# Altium schematic sheet Car_Circuitry.SchDoc
size A3; SheetNumber: 1; SheetTotal: 1
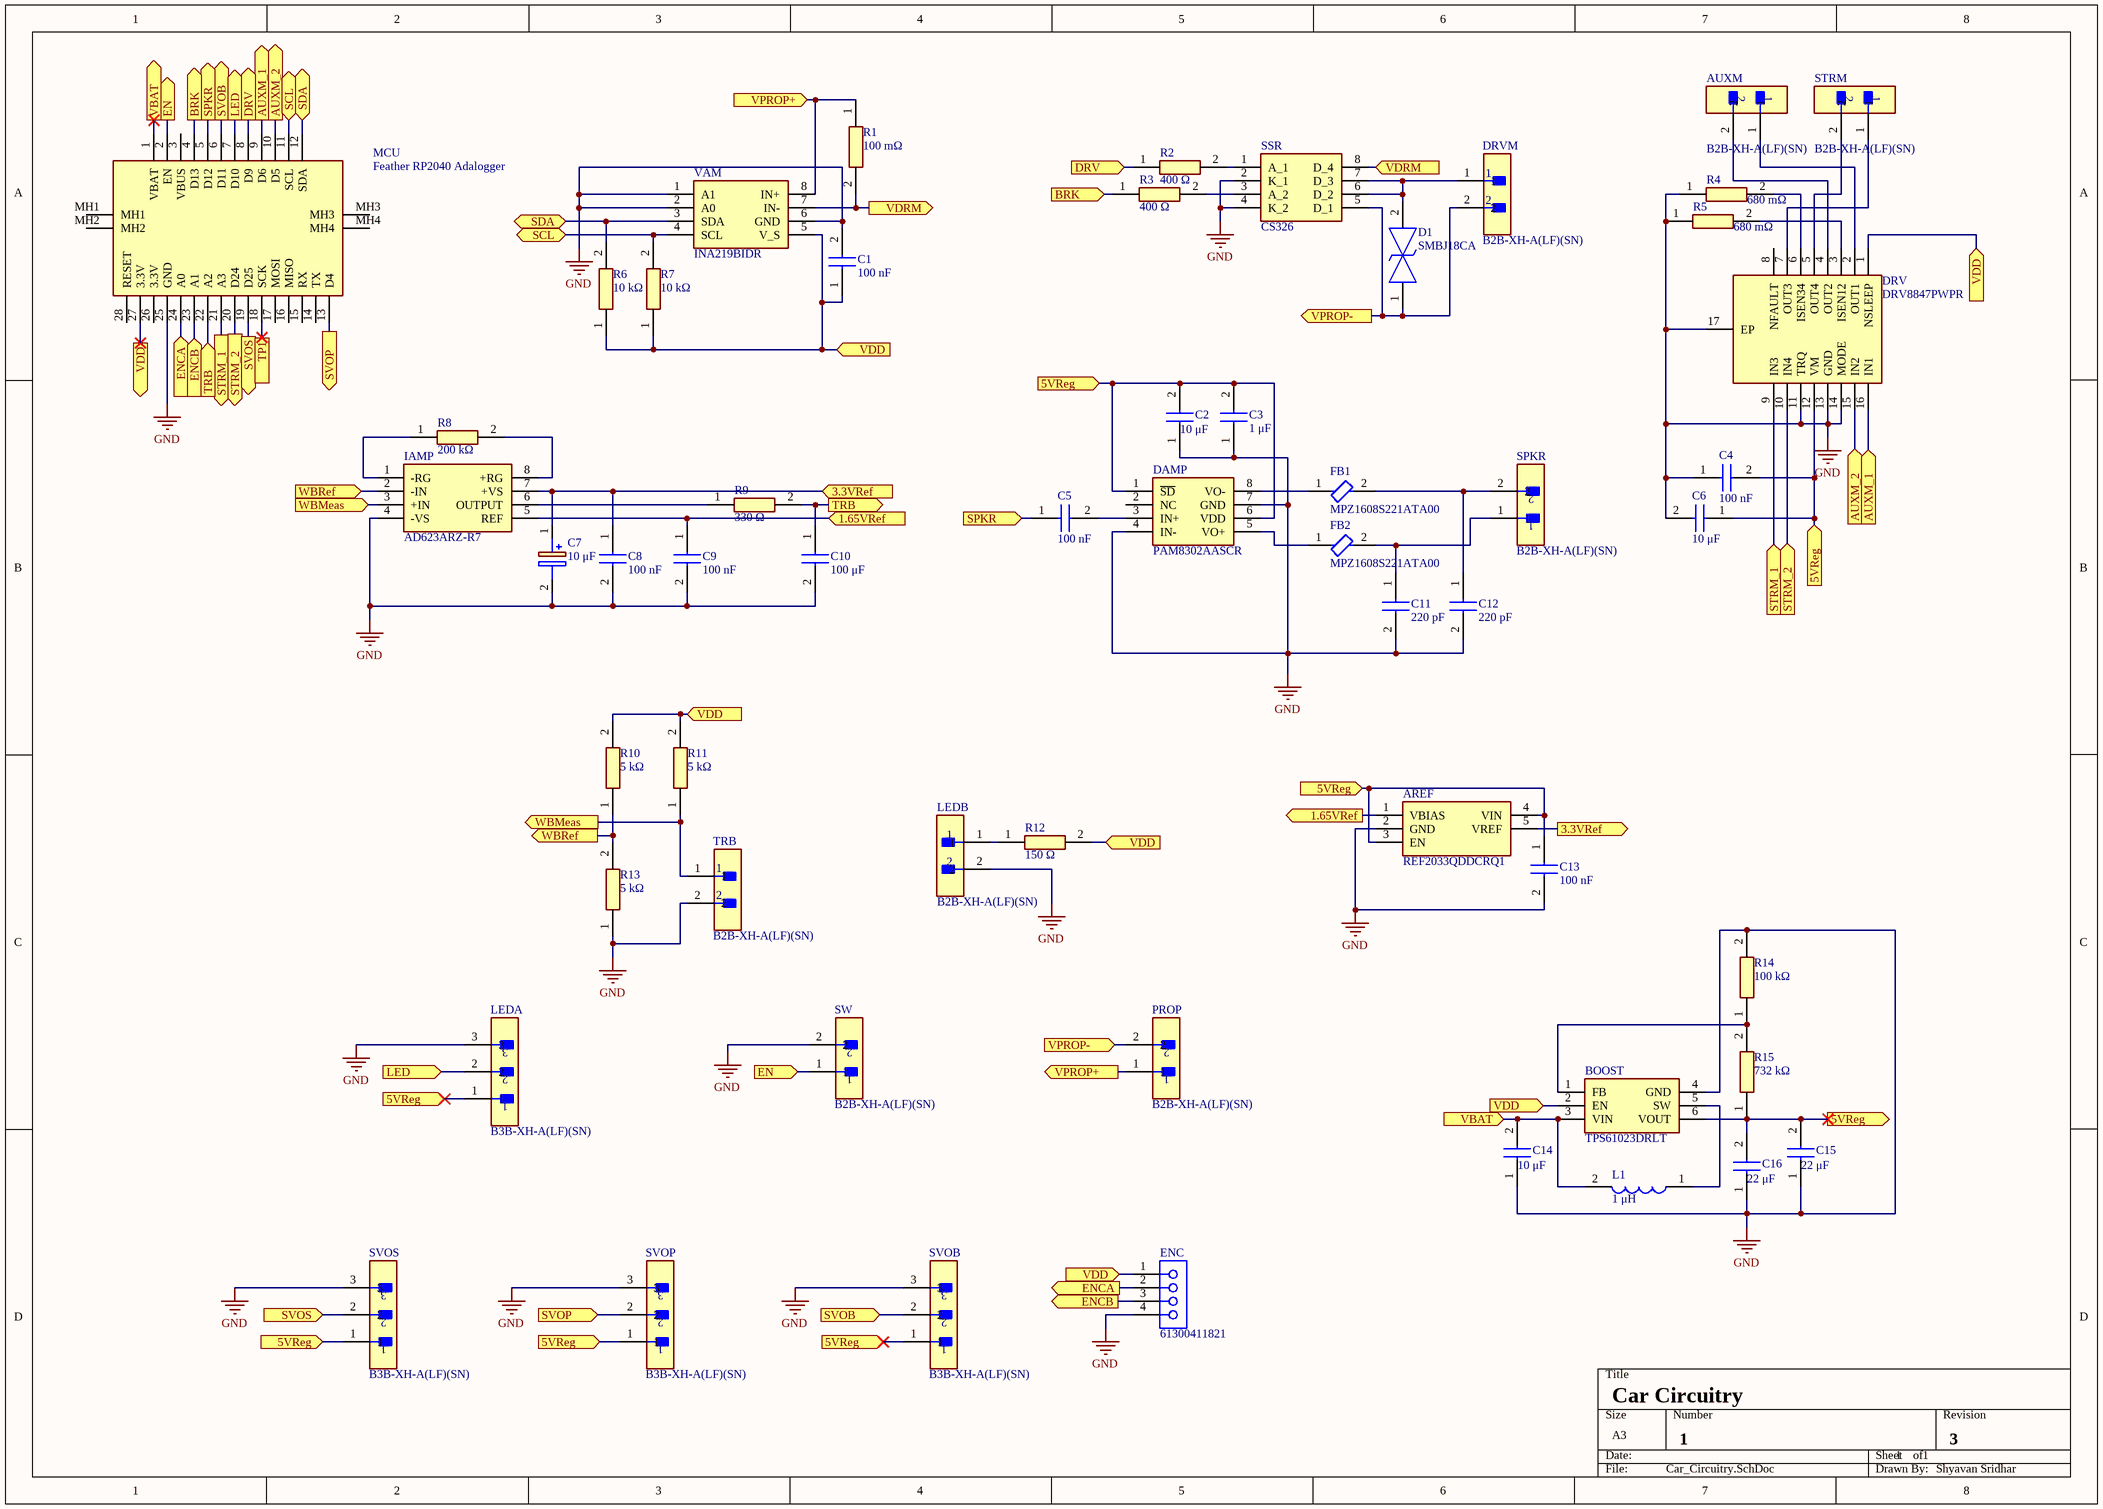
[diagram p0: Car_Circuitry.SchDoc]

## Parts
AREF  REF2033QDDCRQ1  [SOT95P280X110-5N]
AUXM  B2B-XH-A(LF)(SN)  [FP-B2B-XH-A_LF_SN-MFG]
BOOST  TPS61023DRLT  [SOTFL50P160X60-6N]
C1  100 nF  [CAPC2012X95N]
C2  10 μF  [CAPC2012X140N]
C3  1 μF  [C0402C104J4RACTU]
C4  100 nF  [CAPC2012X95N]
C5  100 nF  [CAPC2012X95N]
C6  10 μF  [CAPC2012X140N]
C7  10 μF  [CAPPM3528X210N]
C8  100 nF  [CAPC2012X95N]
C9  100 nF  [CAPC2012X95N]
C10  100 μF  [GRM31x]
C11  220 pF  [GRM033D70J224ME01D]
C12  220 pF  [GRM033D70J224ME01D]
C13  100 nF  [CAPC2012X95N]
C14  10 μF  [CAPC2012X140N]
C15  22 μF  [CAPC3216X180N]
C16  22 μF  [CAPC3216X180N]
D1  SMBJ18CA  [DIOM5436X261N]
DAMP  PAM8302AASCR  [SOP65P490X110-8N]
DRV  DRV8847PWPR  [SOP65P640X120-17N]
DRVM  B2B-XH-A(LF)(SN)  [FP-B2B-XH-A_LF_SN-MFG]
ENC  61300411821  [61300411821]
FB1  MPZ1608S221ATA00  [FP-MPZ1608-0_8-MFG]
FB2  MPZ1608S221ATA00  [FP-MPZ1608-0_8-MFG]
IAMP  AD623ARZ-R7  [SOIC127P600X175-8N]
L1  1 μH  [74438357010]
LEDA  B3B-XH-A(LF)(SN)  [FP-B3B-XH-A_LF_SN-MFG]
LEDB  B2B-XH-A(LF)(SN)  [FP-B2B-XH-A_LF_SN-MFG]
MCU  Feather RP2040 Adalogger  [2796]
PROP  B2B-XH-A(LF)(SN)  [FP-B2B-XH-A_LF_SN-MFG]
R1  100 mΩ  [RESC2013X65N]
R2  400 Ω  [RESC1608X46N]
R3  400 Ω  [RESC1608X46N]
R4  680 mΩ  [ERJ6_B_BW_R_LW_CW_D]
R5  680 mΩ  [ERJ6_B_BW_R_LW_CW_D]
R6  10 kΩ  [RESC1005X40N]
R7  10 kΩ  [RESC1005X40N]
R8  200 kΩ  [ERA6AEB101V]
R9  330 Ω  [RESC1005X40N]
R10  5 kΩ  [RESC0603X26N]
R11  5 kΩ  [RESC0603X26N]
R12  150 Ω  [RESC2012X60N]
R13  5 kΩ  [RESC0603X26N]
R14  100 kΩ  [ERJ8ENF1000V]
R15  732 kΩ  [ERJ8ENF1000V]
SPKR  B2B-XH-A(LF)(SN)  [FP-B2B-XH-A_LF_SN-MFG]
SSR  CS326  [SOP254P1030X390-8N]
STRM  B2B-XH-A(LF)(SN)  [FP-B2B-XH-A_LF_SN-MFG]
SVOB  B3B-XH-A(LF)(SN)  [FP-B3B-XH-A_LF_SN-MFG]
SVOP  B3B-XH-A(LF)(SN)  [FP-B3B-XH-A_LF_SN-MFG]
SVOS  B3B-XH-A(LF)(SN)  [FP-B3B-XH-A_LF_SN-MFG]
SW  B2B-XH-A(LF)(SN)  [FP-B2B-XH-A_LF_SN-MFG]
TRB  B2B-XH-A(LF)(SN)  [FP-B2B-XH-A_LF_SN-MFG]
VAM  INA219BIDR  [SOIC127P600X175-8N]

## Ports
1.65VRef (in), 1.65VRef (out), 3.3VRef (in), 3.3VRef (out), 5VReg (in), 5VReg (out), AUXM_1 (in), AUXM_1 (out), AUXM_2 (in), AUXM_2 (out), BRK (in), BRK (out), DRV (in), DRV (out), EN (in), EN (out), ENCA (in), ENCA (out), ENCB (in), ENCB (out), LED (in), LED (out), SCL (bidir), SDA (bidir), SPKR (in), SPKR (out), STRM_1 (in), STRM_1 (out), STRM_2 (in), STRM_2 (out), SVOB (in), SVOB (out), SVOP (in), SVOP (out), SVOS (in), SVOS (out), TP1, TRB (in), TRB (out), VBAT (in), VBAT (out), VDD (in), VDD (out), VDRM (in), VDRM (out), VPROP+ (in), VPROP+ (out), VPROP- (in), VPROP- (out), WBMeas (in), WBMeas (out), WBRef (in), WBRef (out)

## Nets
GND: AREF.2(GND) BOOST.4(GND) C1.2 C2.1 C3.1 C4.1 C6.2 C7.2(-) C8.2 C9.2 C10.2 C11.2 C12.2 C13.2 C14.1 C15.1 C16.1 DAMP.4(IN-) DAMP.7(GND) DRV.11(TRQ) DRV.13(GND) DRV.14(MODE) DRV.17(EP) ENC.4 IAMP.4(-VS) LEDA.3 LEDB.2 MCU.25(GND) R4.1 R5.1 R13.1 R14.2 SSR.2(K_1) SSR.4(K_2) SVOB.3 SVOP.3 SVOS.3 SW.2 TRB.2 VAM.1(A1) VAM.2(A0) VAM.6(GND)
1.65VRef: AREF.1(VBIAS) C9.1 IAMP.5(REF) ; port 1.65VRef
3.3VRef: AREF.5(VREF) C7.1(+) C8.1 IAMP.7(+VS) ; port 3.3VRef
5VReg: AREF.3(EN) AREF.4(VIN) BOOST.6(VOUT) C2.2 C3.2 C4.2 C6.1 C13.1 C15.2 C16.2 DAMP.1(~{SD}) DAMP.6(VDD) DRV.12(VM) LEDA.1 R15.1 SVOB.1 SVOP.1 SVOS.1 ; port 5VReg
AUXM_1: DRV.16(IN1) MCU.9(D6) ; port AUXM_1
AUXM_2: DRV.15(IN2) MCU.10(D5) ; port AUXM_2
BRK: MCU.4(D13) R3.1 ; port BRK
DRV: MCU.8(D9) R2.1 ; port DRV
EN: MCU.2(EN) SW.1 ; port EN
ENCA: ENC.2 MCU.24(A0) ; port ENCA
ENCB: ENC.3 MCU.23(A1) ; port ENCB
LED: LEDA.2 MCU.7(D10) ; port LED
SCL: MCU.11(SCL) R7.2 VAM.4(SCL) ; port SCL
SDA: MCU.12(SDA) R6.2 VAM.3(SDA) ; port SDA
SPKR: C5.1 MCU.5(D12) ; port SPKR
STRM_1: DRV.9(IN3) MCU.21(A3) ; port STRM_1
STRM_2: DRV.10(IN4) MCU.20(D24) ; port STRM_2
SVOB: MCU.6(D11) SVOB.2 ; port SVOB
SVOP: MCU.13(D4) SVOP.2 ; port SVOP
SVOS: MCU.19(D25) SVOS.2 ; port SVOS
TP1: MCU.18(SCK) ; port TP1
TRB: C10.1 MCU.22(A2) R9.2 ; port TRB
VBAT: BOOST.3(VIN) C14.2 L1.2 MCU.1(VBAT) ; port VBAT
VDD: BOOST.2(EN) C1.1 DRV.1(NSLEEP) ENC.1 MCU.27(3.3V) R6.1 R7.1 R10.2 R11.2 R12.2 VAM.5(V_S) ; port VDD
VDRM: R1.2 SSR.8(D_4) VAM.7(IN-) ; port VDRM
VPROP+: PROP.1 R1.1 VAM.8(IN+) ; port VPROP+
VPROP-: D1.1 DRVM.2 PROP.2 SSR.5(D_1) ; port VPROP-
WBMeas: IAMP.3(+IN) R11.1 TRB.1 ; port WBMeas
WBRef: IAMP.2(-IN) R10.1 R13.2 ; port WBRef
NetAUXM_1: AUXM.1 DRV.2(OUT1)
NetAUXM_2: AUXM.2 DRV.4(OUT2)
NetBOOST_1: BOOST.1(FB) R14.1 R15.2
NetBOOST_5: BOOST.5(SW) L1.1
NetC5_2: C5.2 DAMP.3(IN+)
NetC11_1: C11.1 FB2.2 SPKR.1
NetC12_1: C12.1 FB1.2 SPKR.2
NetD1_2: D1.2 DRVM.1 SSR.6(D_2) SSR.7(D_3)
NetDAMP_5: DAMP.5(VO+) FB2.1
NetDAMP_8: DAMP.8(VO-) FB1.1
NetDRV_3: DRV.3(ISEN12) R5.2
NetDRV_5: DRV.5(OUT4) STRM.2
NetDRV_6: DRV.6(ISEN34) R4.2
NetDRV_7: DRV.7(OUT3) STRM.1
NetIAMP_1: IAMP.1(-RG) R8.1
NetIAMP_6: IAMP.6(OUTPUT) R9.1
NetIAMP_8: IAMP.8(+RG) R8.2
NetLEDB_1: LEDB.1 R12.1
NetR2_2: R2.2 SSR.1(A_1)
NetR3_2: R3.2 SSR.3(A_2)

Not connected (* = marked no-connect by the designer): DAMP 2(NC); DRV 8(NFAULT); MCU 3(VBUS) 14(TX) 15(RX) 16(MISO) 17(MOSI) 26(3.3V) 28(RESET) MH1 MH2 MH3 MH4

## Notes on the sheet
- Car Circuitry
- 1
- 3
- Shyavan Sridhar

## Library data of the parts
AREF = REF2033QDDCRQ1: Integrated Circuit; Manufacturer_Name: Texas Instruments; Datasheet Link: https://www.arrow.com/en/products/ref2033qddcrq1/texas-instruments?region=nac; Height: 1.1mm; Manufacturer_Part_Number: REF2033QDDCRQ1; Mouser Part Number: 595-REF2033QDDCRQ1; Mouser Price/Stock: https://www.mouser.co.uk/ProductDetail/Texas-Instruments/REF2033QDDCRQ1?qs=rSMjJ%252B1ewcT9jXmIxG%2FW%2Fg%3D%3D; Arrow Part Number: REF2033QDDCRQ1; Arrow Price/Stock: https://www.arrow.com/en/products/ref2033qddcrq1/texas-instruments?utm_currency=USD&region=nac
AUXM DRVM LEDB PROP SPKR STRM SW TRB = CMP-2000-05888-3: CONN HEADER VERT 2POS 2.5MM; Current Rating: 3A; Voltage Rating: 250V; Number of Contacts: 2; Contact Resistance: 20mR; Wire/Cable Gauge: 22AWG; Insulation Resistance: 1GR; Connector Type: Male Pin; Packaging: Bulk; Contact Material: Brass; Lead Free: Lead Free; Orientation: Straight; Contact Plating: Tin; Max Current Rating: 3A; Termination: Solder; Fastening Type: Detent; Depth: 5.75mm; Housing Material: Polyamide; REACH SVHC: No SVHC; Series: XH; Voltage Rating (AC): 250V; Number of Positions: 2; Color: Natural; Contact Type: Male Pin; Max Voltage Rating (DC): 250V; Pitch: 2.5mm; Lead Pitch: 2.5mm; Mount: Through Hole; Max Operating Temperature: 85°C; Length: 7.4mm; Max Voltage Rating (AC): 250V; Min Operating Temperature: -25°C; Number of Rows: 1; Housing Color: White
BOOST = TPS61023DRLT: Integrated Circuit; Manufacturer_Name: Texas Instruments; Datasheet Link: http://www.ti.com/general/docs/suppproductinfo.tsp?distId=10&gotoUrl=http%3A%2F%2Fwww.ti.com%2Flit%2Fgpn%2Ftps61023; Height: 0.6mm; Manufacturer_Part_Number: TPS61023DRLT; Mouser Part Number: 595-TPS61023DRLT; Mouser Price/Stock: https://www.mouser.co.uk/ProductDetail/Texas-Instruments/TPS61023DRLT?qs=BJlw7L4Cy78Zr3IJIU3gNw%3D%3D; Arrow Part Number: TPS61023DRLT; Arrow Price/Stock: https://www.arrow.com/en/products/tps61023drlt/texas-instruments?region=nac
C1 C4 C5 C8 C9 C13 = CL21B104KBCNNNC: Capacitor; Manufacturer_Name: SAMSUNG; Datasheet Link: https://datasheet.datasheetarchive.com/originals/distributors/Datasheets_SAMA/86a3eaf0882763ef32124d5901f9b833.pdf; Height: 0.95mm; Manufacturer_Part_Number: CL21B104KBCNNNC; Mouser Part Number: 187-CL21B104KBCNNNC; Mouser Price/Stock: https://www.mouser.co.uk/ProductDetail/Samsung-Electro-Mechanics/CL21B104KBCNNNC?qs=349EhDEZ59pEfpnm5yBEmQ%3D%3D; Arrow Part Number: CL21B104KBCNNNC; Arrow Price/Stock: https://www.arrow.com/en/products/cl21b104kbcnnnc/samsung-electro-mechanics?region=europe
C2 C6 C14 = CL21B106KOQNNNE: Capacitor; Manufacturer_Name: SAMSUNG; Datasheet Link: https://datasheet.datasheetarchive.com/originals/distributors/Datasheets_SAMA/a6a503886ec2e900bbf4e5d6e2f8e8b0.pdf; Height: 1.4mm; Manufacturer_Part_Number: CL21B106KOQNNNE; Mouser Part Number: 187-CL21B106KOQNNNE; Mouser Price/Stock: https://www.mouser.co.uk/ProductDetail/Samsung-Electro-Mechanics/CL21B106KOQNNNE?qs=349EhDEZ59r8qgLddyW2Yw%3D%3D; Arrow Part Number: CL21B106KOQNNNE; Arrow Price/Stock: https://www.arrow.com/en/products/cl21b106koqnnne/samsung-electro-mechanics
C3 = C0402C105K9PACTU: Capacitor; Manufacturer_Name: KEMET; Datasheet Link: https://content.kemet.com/datasheets/KEM_C1002_X7R_SMD.pdf; Height: 0.55mm; Manufacturer_Part_Number: C0402C105K9PACTU; Mouser Part Number: 80-C0402C105K9P; Mouser Price/Stock: https://www.mouser.co.uk/ProductDetail/KEMET/C0402C105K9PACTU?qs=UdQET6xYxVCMExqTDkuPeQ%3D%3D; Arrow Part Number: C0402C105K9PACTU; Arrow Price/Stock: https://www.arrow.com/en/products/c0402c105k9pactu/kemet-corporation?region=nac
C7 = 293D106X9016B2TE3: Capacitor Polarised; Manufacturer_Name: Vishay; Datasheet Link: http://www.vishay.com/docs/40002/293d.pdf; Height: 2.1mm; Manufacturer_Part_Number: 293D106X9016B2TE3; Mouser Part Number: 74-293D106X9016B2TE3; Mouser Price/Stock: https://www.mouser.co.uk/ProductDetail/Vishay-Sprague/293D106X9016B2TE3?qs=wgO0AD0o1vsITAGguIIpRA%3D%3D; Arrow Part Number: 293D106X9016B2TE3; Arrow Price/Stock: https://www.arrow.com/en/products/293d106x9016b2te3/vishay?region=nac
C10 = GRM31CD80J107MEA8K: Capacitor; Manufacturer_Name: Murata Electronics; Datasheet Link: https://search.murata.co.jp/Ceramy/image/img/A01X/G101/ENG/GRM31CD80J107MEA8-01A.pdf; Height: 1.25mm; Manufacturer_Part_Number: GRM31CD80J107MEA8K; Mouser Part Number: 81-GRM31CD80J107MA8K; Mouser Price/Stock: https://www.mouser.co.uk/ProductDetail/Murata-Electronics/GRM31CD80J107MEA8K?qs=hd1VzrDQEGjqZLplFGf8IQ%3D%3D
C11 C12 = GRM033R71C221KA01D: Capacitor; Manufacturer_Name: Murata Electronics; Datasheet Link: https://search.murata.co.jp/Ceramy/image/img/A01X/G101/ENG/GRM033R71C221KA01-01A.pdf; Height: 0.33mm; Manufacturer_Part_Number: GRM033R71C221KA01D; Mouser Part Number: 81-GRM033R71C221KA1D; Mouser Price/Stock: https://www.mouser.com/Search/Refine.aspx?Keyword=81-GRM033R71C221KA1D
C15 C16 = CL31B226KPHNNNE: Capacitor; Manufacturer_Name: SAMSUNG; Datasheet Link: https://media.digikey.com/pdf/Data%20Sheets/Samsung%20PDFs/CL_Series_MLCC_ds.pdf; Height: 1.8mm; Manufacturer_Part_Number: CL31B226KPHNNNE; Mouser Part Number: 187-CL31B226KPHNNNE; Mouser Price/Stock: https://www.mouser.co.uk/ProductDetail/Samsung-Electro-Mechanics/CL31B226KPHNNNE?qs=EHbfJsBkB6nWZLDFWYPW4w%3D%3D; Arrow Part Number: CL31B226KPHNNNE; Arrow Price/Stock: https://www.arrow.com/en/products/cl31b226kphnnne/samsung-electro-mechanics?region=nac
D1 = SMBJ18CA: TVS Diode (Bi-directional); Manufacturer_Name: LITTELFUSE; Datasheet Link: http://www.littelfuse.com/~/media/electronics/datasheets/tvs_diodes/littelfuse_tvs_diode_smbj_datasheet.pdf.pdf; Height: 2.61mm; Manufacturer_Part_Number: SMBJ18CA; Mouser Part Number: 576-SMBJ18CA; Mouser Price/Stock: https://www.mouser.co.uk/ProductDetail/Littelfuse/SMBJ18CA?qs=HR2RnyOI4E5LXIGVih8ojg%3D%3D; Arrow Part Number: SMBJ18CA; Arrow Price/Stock: https://www.arrow.com/en/products/smbj18ca/littelfuse?utm_currency=USD&region=nac
DAMP = PAM8302AASCR: Integrated Circuit; Manufacturer_Name: Diodes Incorporated; Datasheet Link: https://www.diodes.com/assets/Datasheets/PAM8302A.pdf; Height: 1.1mm; Manufacturer_Part_Number: PAM8302AASCR; Mouser Part Number: 621-PAM8302AASCR; Mouser Price/Stock: https://www.mouser.co.uk/ProductDetail/Diodes-Incorporated/PAM8302AASCR?qs=pYVYkI7xuRXTVZEQSGcDyg%3D%3D; Arrow Part Number: PAM8302AASCR; Arrow Price/Stock: https://www.arrow.com/en/products/pam8302aascr/diodes-incorporated?utm_currency=USD&region=nac
DRV = DRV8847PWPR: Integrated Circuit; Manufacturer_Name: Texas Instruments; Datasheet Link: http://www.ti.com/general/docs/lit/getliterature.tsp?genericPartNumber=DRV8847&fileType=pdf&HQS=ti-null-null-sf-df-pf-sep-wwe&DCM=yes; Height: 1.2mm; Manufacturer_Part_Number: DRV8847PWPR; Mouser Part Number: 595-DRV8847PWPR; Mouser Price/Stock: https://www.mouser.co.uk/ProductDetail/Texas-Instruments/DRV8847PWPR?qs=w%2Fv1CP2dgqrvdo8J8mfnIQ%3D%3D; Arrow Part Number: DRV8847PWPR; Arrow Price/Stock: https://www.arrow.com/en/products/drv8847pwpr/texas-instruments
ENC = CMP-1502-01316-4: THT Vertical Socket Header WR-PHD, Pitch 2.54 mm, Single Row, 4 pins; Contact Resistance: 20mΩ; Gender: Female; Current Rating: 3A; Operating Supply Voltage: 250V; Number of Pins: 4; Orientation: Vertical; Lead Pitch: 2.54mm
FB1 FB2 = CMP-08257-000028-1: Power line Ferrite Bead 220Ω @ 100MHz 2.2A DCR 0.05Ω SMD 0603; DC Resistance (DCR): 50mR; Tolerance: 25%; Impedance: 220R; Series: MPZ; Width: 0.031inch; REACH SVHC: No SVHC; Case Code (Imperial): 0603; Current Rating: 2.2A; Case/Package: 0603; Packaging: Cut Tape; Height: 0.037inch; Number of Pins: 2; Max DC Current: 2.2A; Lead Free: Lead Free; RoHS Compliant: Yes; Mount: Surface Mount; Case Code (Metric): 1608; Length: 0.063inch; Package Quantity: 1; Core Material: Ferrite
IAMP = AD623AR-REEL7: Integrated Circuit; Manufacturer_Name: Analog Devices; Datasheet Link: https://componentsearchengine.com/Datasheets/1/AD623AR-REEL7.pdf; Height: 1.75mm; Manufacturer_Part_Number: AD623AR-REEL7; Mouser Part Number: 584-AD623AR-R7; Mouser Price/Stock: http://www.mouser.com/Search/ProductDetail.aspx?qs=NmRFExCfTkEbmJR8gDz96w%3d%3d
L1 = 74438357010: Inductor; Manufacturer_Name: Wurth Elektronik; Datasheet Link: https://katalog.we-online.de/pbs/datasheet/74438357010.pdf; Height: 3.1mm; Manufacturer_Part_Number: 74438357010; Mouser Part Number: 710-74438357010; Mouser Price/Stock: https://www.mouser.co.uk/ProductDetail/Wurth-Elektronik/74438357010?qs=AQlKX63v8RstGPuQmrueWg%3D%3D
LEDA SVOB SVOP SVOS = CMP-17439-000014-3: CONN HEADER VERT 3POS 2.5MM; Max Voltage Rating (DC): 250V; Number of Positions: 3; Current Rating: 3A; Gender: Male; Wire/Cable Gauge: 22AWG; Contact Resistance: 20mR; Insulation Resistance: 1GR; Insulation Material: Nylon; Contact Plating: Tin; Depth: 5.75mm; Contact Type: Male Pin; Max Operating Temperature: 85°C; Insulation Color: Natural; Voltage Rating (AC): 250V; Color: Natural; Connector Type: Header; Orientation: Straight; Fastening Type: Detent; Housing Color: White; Min Operating Temperature: -25°C; Termination: Solder; Voltage Rating: 250V; Series: XH; Pitch: 2.5mm; Contact Shape: Square; Number of Rows: 1; Lead Free: Lead Free; Packaging: Bulk; Mount: Through Hole; Flammability Rating: UL94 V-0; Max Voltage Rating (AC): 250V; REACH SVHC: No SVHC; Housing Material: Polyamide; Contact Material: Brass; Lead Pitch: 2.5mm; Contact Finish - Mating: TIN; Length: 9.9mm; Max Current Rating: 3A; Number of Contacts: 3
MCU = 2796: Adafruit Microcontroller; Manufacturer_Part_Number: 4884; Datasheet Link: https://learn.adafruit.com/adafruit-feather-rp2040-adalogger/; Height: 8mm; Manufacturer_Name: Adafruit; Mouser Part Number: 485-5980; Mouser Price/Stock: https://www.mouser.com/ProductDetail/Adafruit/5980?qs=IKkN%2F947nfCnlS5PgbpnkA%3D%3D; Arrow Part Number: 4884; Arrow Price/Stock: https://www.arrow.com/en/products/4884/adafruit-industries
R1 = RCWE0805R100FKEA: Resistor; Manufacturer_Name: Vishay; Datasheet Link: https://www.vishay.com/docs/20019/rcwe.pdf; Height: 0.65mm; Manufacturer_Part_Number: RCWE0805R100FKEA; Mouser Part Number: 71-RCWE0805R100FKEA; Mouser Price/Stock: https://www.mouser.co.uk/ProductDetail/Vishay-Dale/RCWE0805R100FKEA?qs=tL36CZ7EjgSyC2ZeY9Ik2g%3D%3D
R2 R3 = PAT0603E4000BST1: Resistor; Manufacturer_Name: Vishay; Datasheet Link: https://www.vishay.com/docs/60024/pat.pdf; Height: 0.457mm; Manufacturer_Part_Number: PAT0603E4000BST1; Mouser Part Number: 71-PAT0603E4000BST1; Mouser Price/Stock: https://www.mouser.co.uk/ProductDetail/Vishay-Thin-Film/PAT0603E4000BST1?qs=Bakm8ERcljqViks9GK20nA%3D%3D; Arrow Part Number: PAT0603E4000BST1; Arrow Price/Stock: https://www.arrow.com/en/products/pat0603e4000bst1/vishay
R4 R5 = ERJ-6DQJR68V: Resistor; Manufacturer_Name: Panasonic; Datasheet Link: http://industrial.panasonic.com/cdbs/www-data/pdf/RDN0000/AOA0000C313.pdf; Manufacturer_Part_Number: ERJ-6DQJR68V; Arrow Part Number: ERJ-6DQJR68V; Arrow Price/Stock: https://www.arrow.com/en/products/erj-6dqjr68v/panasonic
R6 R7 = RC0402JR-0710KL: Resistor; Manufacturer_Name: YAGEO; Datasheet Link: https://www.yageo.com/upload/media/product/productsearch/datasheet/rchip/PYu-RC_Group_51_RoHS_L_12.pdf; Height: 0.4mm; Manufacturer_Part_Number: RC0402JR-0710KL; Mouser Part Number: 603-RC0402JR-0710KL; Mouser Price/Stock: https://www.mouser.co.uk/ProductDetail/YAGEO/RC0402JR-0710KL?qs=V1yeUXFNrkk4BhFptVo0Rw%3D%3D; Arrow Part Number: RC0402JR-0710KL; Arrow Price/Stock: https://www.arrow.com/en/products/rc0402jr-0710kl/yageo?utm_currency=USD&region=europe
R8 = ERA-6AEB204V: Resistor; Manufacturer_Name: Panasonic; Datasheet Link: https://industrial.panasonic.com/cdbs/www-data/pdf/RDM0000/AOA0000C307.pdf; Height: 0.6mm; Manufacturer_Part_Number: ERA-6AEB204V; Mouser Part Number: 667-ERA-6AEB204V; Mouser Price/Stock: https://www.mouser.co.uk/ProductDetail/Panasonic/ERA-6AEB204V?qs=nho8PGNfA6pnUIygri3Lhw%3D%3D; Arrow Part Number: ERA-6AEB204V; Arrow Price/Stock: https://www.arrow.com/en/products/era6aeb204v/panasonic
R9 = RC0402FR-07330RL: Resistor; Manufacturer_Name: KEMET; Datasheet Link: http://www.yageo.com/documents/recent/PYu-RC0402_51_RoHS_L_6_r.pdf; Height: 0.4mm; Manufacturer_Part_Number: RC0402FR-07330RL; Mouser Part Number: 603-RC0402FR-07330RL; Mouser Price/Stock: https://www.mouser.co.uk/ProductDetail/Yageo/RC0402FR-07330RL?qs=V1yeUXFNrkngRWHRQxns%2Fg%3D%3D; Arrow Part Number: RC0402FR-07330RL; Arrow Price/Stock: https://www.arrow.com/en/products/rc0402fr-07330rl/yageo
R10 R11 R13 = TNPW02015K00BEED: Resistor; Manufacturer_Name: Vishay; Datasheet Link: https://www.vishay.com/docs/28758/tnpw_e3.pdf; Height: 0.26mm; Manufacturer_Part_Number: TNPW02015K00BEED; Mouser Part Number: 71-TNPW02015K00BEED; Mouser Price/Stock: https://www.mouser.co.uk/ProductDetail/Vishay-Dale/TNPW02015K00BEED?qs=GBLSl2AkirvkqBgWZm4PiQ%3D%3D; Arrow Part Number: TNPW02015K00BEED; Arrow Price/Stock: https://www.arrow.com/en/products/tnpw02015k00beed/vishay?utm_currency=USD&region=nac
R12 = RK73B2ATTD151J: Resistor; Manufacturer_Name: KOA Speer; Datasheet Link: https://www.arrow.com/en/products/rk73b2attd151j/koa-speer-electronics; Height: 0.6mm; Manufacturer_Part_Number: RK73B2ATTD151J; Mouser Part Number: 660-RK73B2ATTD151J; Mouser Price/Stock: https://www.mouser.co.uk/ProductDetail/KOA-Speer/RK73B2ATTD151J?qs=Eg3swSo9kV1ngoeZFqQs4w%3D%3D; Arrow Part Number: RK73B2ATTD151J; Arrow Price/Stock: https://www.arrow.com/en/products/rk73b2attd151j/koa-speer-electronics?utm_currency=USD&region=nac
R14 = ERJ-8ENF1003V: Resistor; Manufacturer_Name: Panasonic; Datasheet Link: https://industrial.panasonic.com/cdbs/www-data/pdf/RDA0000/AOA0000C86.pdf; Height: 0.7mm; Manufacturer_Part_Number: ERJ-8ENF1003V; Mouser Part Number: 667-ERJ-8ENF1003V; Mouser Price/Stock: https://www.mouser.co.uk/ProductDetail/Panasonic/ERJ-8ENF1003V?qs=8%252BG0TiN%2FgVoayg2hl%252BJeeg%3D%3D; Arrow Part Number: ERJ-8ENF1003V; Arrow Price/Stock: https://www.arrow.com/en/products/erj-8enf1003v/panasonic?region=nac
R15 = ERJ-8ENF7323V: Resistor; Manufacturer_Name: Panasonic; Datasheet Link: https://industrial.panasonic.com/cdbs/www-data/pdf/RDA0000/AOA0000C86.pdf; Height: 0.7mm; Manufacturer_Part_Number: ERJ-8ENF7323V; Mouser Part Number: 667-ERJ-8ENF7323V; Mouser Price/Stock: https://www.mouser.co.uk/ProductDetail/Panasonic/ERJ-8ENF7323V?qs=Ow%252BOiPmaljHJ6lt%2FbxwsiQ%3D%3D
SSR = CS326: Relay or Contactor; Manufacturer_Name: Coto Technology; Datasheet Link: https://componentsearchengine.com/Datasheets/1/CS326.pdf; Height: 3.9mm; Manufacturer_Part_Number: CS326; Mouser Part Number: 816-CS326; Mouser Price/Stock: https://www.mouser.co.uk/ProductDetail/Coto-Technology/CS326?qs=Awm7IEb3pyEQ4ykqCGUh%252BA%3D%3D
VAM = INA219BIDR: Integrated Circuit; Manufacturer_Name: Texas Instruments; Datasheet Link: https://www.ti.com/lit/ds/symlink/ina219.pdf?HQS=TI-null-null-digikeymode-df-pf-null-wwe&ts=1601223553719; Height: 1.75mm; Manufacturer_Part_Number: INA219BIDR; Mouser Part Number: 595-INA219BIDR; Mouser Price/Stock: https://www.mouser.co.uk/ProductDetail/Texas-Instruments/INA219BIDR?qs=1WmUhT%2FVMINyGsXNJcdD5Q%3D%3D; Arrow Part Number: INA219BIDR; Arrow Price/Stock: https://www.arrow.com/en/products/ina219bidr/texas-instruments?utm_currency=USD&region=nac